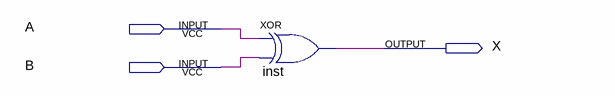
[diagram p0: schematic sheet]
// Quartus schematic Xor-1-bit.bdf as structural Verilog: 1 symbols, 3 pins
module \Xor-1-bit  (
  input  A,
  input  B,
  output X
);

  xor inst (X, A, B);
endmodule
